# Altium project Fri3D_2020_Sweet4x4_01.PrjPcb
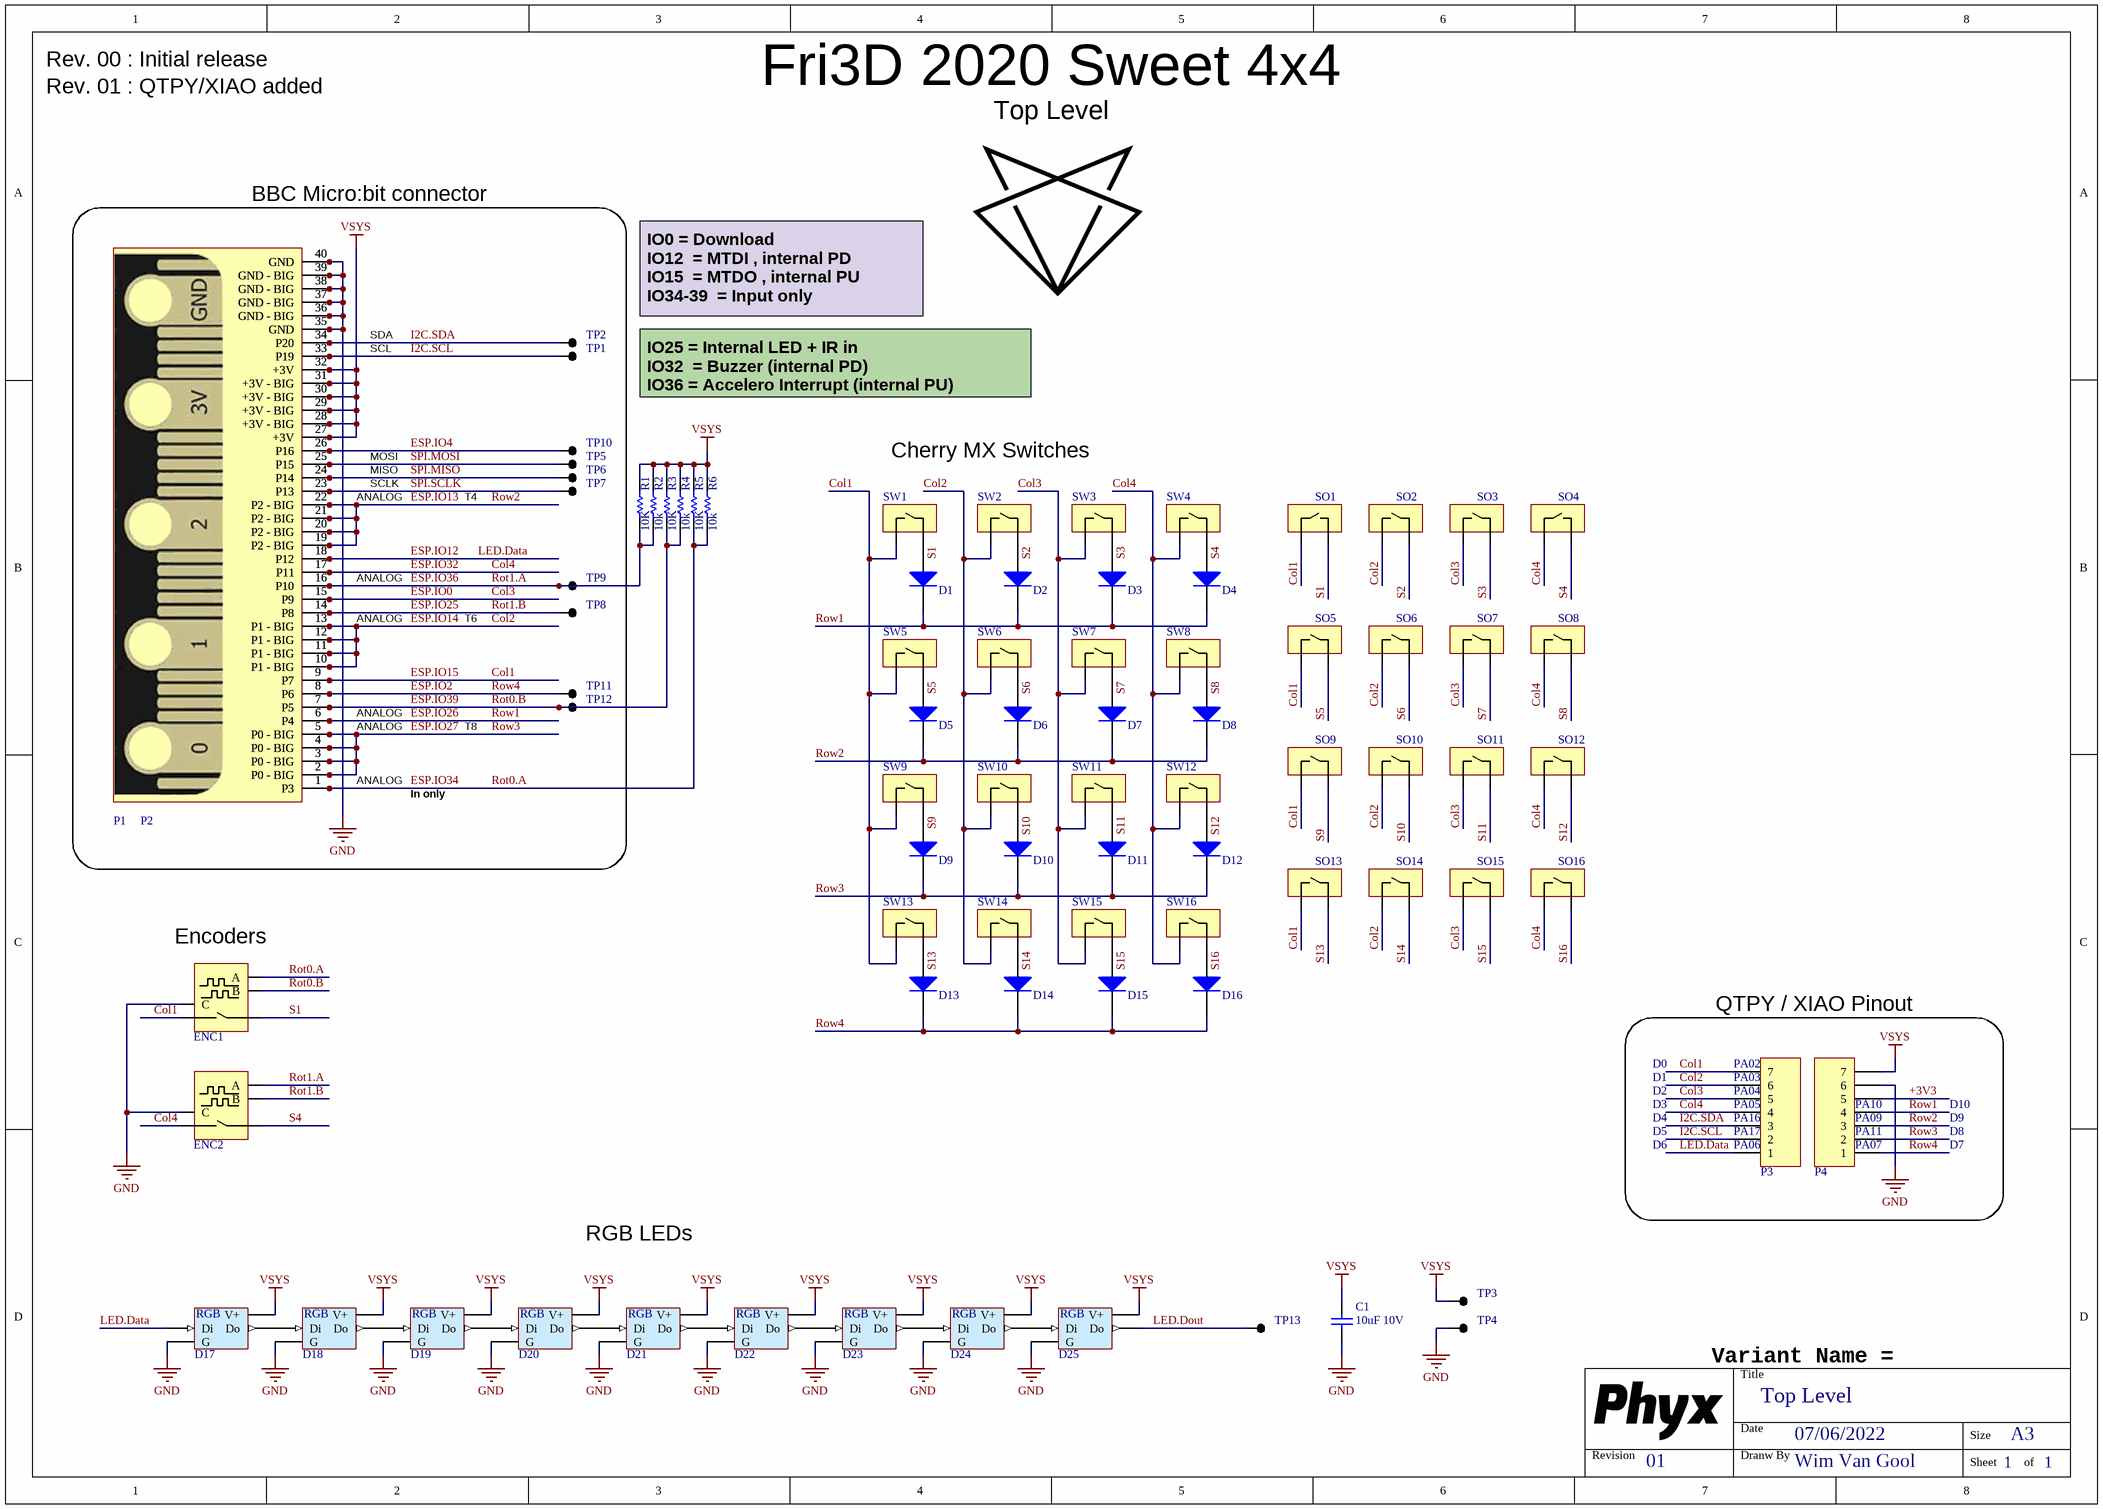
[diagram p0: Fri3D_2020_Sweet4x4_01.SchDoc]
PCB_ENGINEER: WimVG; PCB_REV: 01; PCB_TITLE: Fri3D 2020 Sweet 4x4
1 sheet, 83 parts. Net scope: global (net labels, ports and power ports of the same name join across sheets).
Board file: Fri3D_2020_Sweet4x4_01.PcbDoc

## Sheet Fri3D_2020_Sweet4x4_01.SchDoc: Top Level
size A3; Date: 07/06/2022; DrawnBy: Wim Van Gool; DocumentNumber: 1; Revision: 01; SheetNumber: 1; SheetTotal: 1

### Parts
C1  value 10uF 10V  [C0805_N]  (hidden comment: CAP_CERAMIC)
D1  1N4148 100V 200mA 1Vf@10mA  [DO-35]  (value not drawn)
D2  1N4148 100V 200mA 1Vf@10mA  [DO-35]  (value not drawn)
D3  1N4148 100V 200mA 1Vf@10mA  [DO-35]  (value not drawn)
D4  1N4148 100V 200mA 1Vf@10mA  [DO-35]  (value not drawn)
D5  1N4148 100V 200mA 1Vf@10mA  [DO-35]  (value not drawn)
D6  1N4148 100V 200mA 1Vf@10mA  [DO-35]  (value not drawn)
D7  1N4148 100V 200mA 1Vf@10mA  [DO-35]  (value not drawn)
D8  1N4148 100V 200mA 1Vf@10mA  [DO-35]  (value not drawn)
D9  1N4148 100V 200mA 1Vf@10mA  [DO-35]  (value not drawn)
D10  1N4148 100V 200mA 1Vf@10mA  [DO-35]  (value not drawn)
D11  1N4148 100V 200mA 1Vf@10mA  [DO-35]  (value not drawn)
D12  1N4148 100V 200mA 1Vf@10mA  [DO-35]  (value not drawn)
D13  1N4148 100V 200mA 1Vf@10mA  [DO-35]  (value not drawn)
D14  1N4148 100V 200mA 1Vf@10mA  [DO-35]  (value not drawn)
D15  1N4148 100V 200mA 1Vf@10mA  [DO-35]  (value not drawn)
D16  1N4148 100V 200mA 1Vf@10mA  [DO-35]  (value not drawn)
D17  WS2812 based digital RGB LED 5050 Black package  [LED_5050_WS2812B_BLACK]  (value not drawn)
D18  WS2812 based digital RGB LED 5050 Black package  [LED_5050_WS2812B_BLACK]  (value not drawn)
D19  WS2812 based digital RGB LED 5050 Black package  [LED_5050_WS2812B_BLACK]  (value not drawn)
D20  WS2812 based digital RGB LED 5050 Black package  [LED_5050_WS2812B_BLACK]  (value not drawn)
D21  WS2812 based digital RGB LED 5050 Black package  [LED_5050_WS2812B_BLACK]  (value not drawn)
D22  WS2812 based digital RGB LED 5050 Black package  [LED_5050_WS2812B_BLACK]  (value not drawn)
D23  WS2812 based digital RGB LED 5050 Black package  [LED_5050_WS2812B_BLACK]  (value not drawn)
D24  WS2812 based digital RGB LED 5050 Black package  [LED_5050_WS2812B_BLACK]  (value not drawn)
D25  WS2812 based digital RGB LED 5050 Black package  [LED_5050_WS2812B_BLACK]  (value not drawn)
ENC1  Rotary Encoder with Switch  [PEC11-4215F-S0024]  (value not drawn)
ENC2  Rotary Encoder with Switch  [PEC11-4215F-S0024]  (value not drawn)
P1  MicroBit 90deg connector Cylconn  [MicroBIT_CYLCONN_SMD_90]  (value not drawn)
P2  MicroBit 180deg connector Cylconn  [MicroBIT_CYLCONN_SMD_180]  (value not drawn)
P3  Header 7  [HDR1X7]  (value not drawn)
P4  Header 7  [HDR1X7]  (value not drawn)
R1  value 10K  [R0603_N]  (hidden comment: RESISTOR)
R2  value 10k  [RES_10mm]  (hidden comment: RESISTOR)
R3  value 10K  [R0603_N]  (hidden comment: RESISTOR)
R4  value 10k  [RES_10mm]  (hidden comment: RESISTOR)
R5  value 10K  [R0603_N]  (hidden comment: RESISTOR)
R6  value 10k  [RES_10mm]  (hidden comment: RESISTOR)
SO1  Kailh MX Socket  [Kailh_MX_Socket]  (value not drawn)
SO2  Kailh MX Socket  [Kailh_MX_Socket]  (value not drawn)
SO3  Kailh MX Socket  [Kailh_MX_Socket]  (value not drawn)
SO4  Kailh MX Socket  [Kailh_MX_Socket]  (value not drawn)
SO5  Kailh MX Socket  [Kailh_MX_Socket]  (value not drawn)
SO6  Kailh MX Socket  [Kailh_MX_Socket]  (value not drawn)
SO7  Kailh MX Socket  [Kailh_MX_Socket]  (value not drawn)
SO8  Kailh MX Socket  [Kailh_MX_Socket]  (value not drawn)
SO9  Kailh MX Socket  [Kailh_MX_Socket]  (value not drawn)
SO10  Kailh MX Socket  [Kailh_MX_Socket]  (value not drawn)
SO11  Kailh MX Socket  [Kailh_MX_Socket]  (value not drawn)
SO12  Kailh MX Socket  [Kailh_MX_Socket]  (value not drawn)
SO13  Kailh MX Socket  [Kailh_MX_Socket]  (value not drawn)
SO14  Kailh MX Socket  [Kailh_MX_Socket]  (value not drawn)
SO15  Kailh MX Socket  [Kailh_MX_Socket]  (value not drawn)
SO16  Kailh MX Socket  [Kailh_MX_Socket]  (value not drawn)
SW1  Cherry MX Blue  [Cherry_MX1A]  (value not drawn)
SW2  Cherry MX Blue  [Cherry_MX1A]  (value not drawn)
SW3  Cherry MX Blue  [Cherry_MX1A]  (value not drawn)
SW4  Cherry MX Blue  [Cherry_MX1A]  (value not drawn)
SW5  Cherry MX Blue  [Cherry_MX1A]  (value not drawn)
SW6  Cherry MX Blue  [Cherry_MX1A]  (value not drawn)
SW7  Cherry MX Blue  [Cherry_MX1A]  (value not drawn)
SW8  Cherry MX Blue  [Cherry_MX1A]  (value not drawn)
SW9  Cherry MX Blue  [Cherry_MX1A]  (value not drawn)
SW10  Cherry MX Blue  [Cherry_MX1A]  (value not drawn)
SW11  Cherry MX Blue  [Cherry_MX1A]  (value not drawn)
SW12  Cherry MX Blue  [Cherry_MX1A]  (value not drawn)
SW13  Cherry MX Blue  [Cherry_MX1A]  (value not drawn)
SW14  Cherry MX Blue  [Cherry_MX1A]  (value not drawn)
SW15  Cherry MX Blue  [Cherry_MX1A]  (value not drawn)
SW16  Cherry MX Blue  [Cherry_MX1A]  (value not drawn)
TP1  TEST_PAD  [TP_1.5mm_0.9mm]  (value not drawn)
TP2  TEST_PAD  [TP_1.5mm_0.9mm]  (value not drawn)
TP3  TEST_PAD  [TP_1.5mm_0.9mm]  (value not drawn)
TP4  TEST_PAD  [TP_1.5mm_0.9mm]  (value not drawn)
TP5  TEST_PAD  [TP_1.5mm_0.9mm]  (value not drawn)
TP6  TEST_PAD  [TP_1.5mm_0.9mm]  (value not drawn)
TP7  TEST_PAD  [TP_1.5mm_0.9mm]  (value not drawn)
TP8  TEST_PAD  [TP_1.5mm_0.9mm]  (value not drawn)
TP9  TEST_PAD  [TP_1.5mm_0.9mm]  (value not drawn)
TP10  TEST_PAD  [TP_1.5mm_0.9mm]  (value not drawn)
TP11  TEST_PAD  [TP_1.5mm_0.9mm]  (value not drawn)
TP12  TEST_PAD  [TP_1.5mm_0.9mm]  (value not drawn)
TP13  TEST_PAD  [TP_1.5mm_0.9mm]  (value not drawn)

### Blocks framed on the sheet
BBC Micro:bit connector: P1 P2 TP1 TP2 TP5-TP12
QTPY / XIAO Pinout: P3 P4

### Nets
GND: C1.2 D17.3(G) D18.3(G) D19.3(G) D20.3(G) D21.3(G) D22.3(G) D23.3(G) D24.3(G) D25.3(G) ENC1.C ENC2.C P1.35(GND) P1.36(GND_-_BIG) P1.37(GND_-_BIG) P1.38(GND_-_BIG) P1.39(GND_-_BIG) P1.40(GND) P2.35(GND) P2.36(GND_-_BIG) P2.37(GND_-_BIG) P2.38(GND_-_BIG) P2.39(GND_-_BIG) P2.40(GND) P4.6 TP4.1
VSYS: C1.1 D17.1(V+) D18.1(V+) D19.1(V+) D20.1(V+) D21.1(V+) D22.1(V+) D23.1(V+) D24.1(V+) D25.1(V+) P1.27(+3V) P1.28(+3V_-_BIG) P1.29(+3V_-_BIG) P1.30(+3V_-_BIG) P1.31(+3V_-_BIG) P1.32(+3V) P2.27(+3V) P2.28(+3V_-_BIG) P2.29(+3V_-_BIG) P2.30(+3V_-_BIG) P2.31(+3V_-_BIG) P2.32(+3V) P4.7 R1.1 R2.1 R3.1 R4.1 R5.1 R6.1 TP3.1
+3V3: P4.5
Col1: ENC1.1 P1.9(P7) P2.9(P7) P3.7 SO1.2 SO5.1 SO9.1 SO13.1 SW1.1 SW5.1 SW9.1 SW13.1  [also labelled ESP.IO15]
Col2: P1.10(P1_-_BIG) P1.11(P1_-_BIG) P1.12(P1_-_BIG) P1.13(P1_-_BIG) P2.10(P1_-_BIG) P2.11(P1_-_BIG) P2.12(P1_-_BIG) P2.13(P1_-_BIG) P3.6 SO2.1 SO6.1 SO10.1 SO14.1 SW2.1 SW6.1 SW10.1 SW14.1  [also labelled ESP.IO14]
Col3: P1.15(P9) P2.15(P9) P3.5 SO3.1 SO7.1 SO11.1 SO15.1 SW3.1 SW7.1 SW11.1 SW15.1  [also labelled ESP.IO0]
Col4: ENC2.1 P1.17(P11) P2.17(P11) P3.4 SO4.2 SO8.1 SO12.1 SO16.1 SW4.1 SW8.1 SW12.1 SW16.1  [also labelled ESP.IO32]
ESP.IO2: D13.C D14.C D15.C D16.C P1.8(P6) P2.8(P6) P4.1 TP11.1  [also labelled Row4]
ESP.IO4: P1.26(P16) P2.26(P16) TP10.1
ESP.IO12: D17.4(Di) P1.18(P12) P2.18(P12) P3.1  [also labelled LED.Data]
ESP.IO13: D5.C D6.C D7.C D8.C P1.19(P2_-_BIG) P1.20(P2_-_BIG) P1.21(P2_-_BIG) P1.22(P2_-_BIG) P2.19(P2_-_BIG) P2.20(P2_-_BIG) P2.21(P2_-_BIG) P2.22(P2_-_BIG) P4.3  [also labelled Row2]
ESP.IO25: ENC2.B P1.14(P8) P2.14(P8) TP8.1  [also labelled Rot1.B]
ESP.IO26: D1.C D2.C D3.C D4.C P1.6(P4) P2.6(P4) P4.4  [also labelled Row1]
ESP.IO27: D9.C D10.C D11.C D12.C P1.2(P0_-_BIG) P1.3(P0_-_BIG) P1.4(P0_-_BIG) P1.5(P0_-_BIG) P2.2(P0_-_BIG) P2.3(P0_-_BIG) P2.4(P0_-_BIG) P2.5(P0_-_BIG) P4.2  [also labelled Row3]
ESP.IO34: ENC1.A P1.1(P3) P2.1(P3) R5.2 R6.2  [also labelled Rot0.A]
ESP.IO36: ENC2.A P1.16(P10) P2.16(P10) R1.2 R2.2 TP9.1  [also labelled Rot1.A]
ESP.IO39: ENC1.B P1.7(P5) P2.7(P5) R3.2 R4.2 TP12.1  [also labelled Rot0.B]
I2C.SCL: P1.33(P19) P2.33(P19) P3.2 TP1.1
I2C.SDA: P1.34(P20) P2.34(P20) P3.3 TP2.1
LED.Dout: D25.2(Do) TP13.1
S1: D1.A ENC1.2 SO1.1 SW1.2
S2: D2.A SO2.2 SW2.2
S3: D3.A SO3.2 SW3.2
S4: D4.A ENC2.2 SO4.1 SW4.2
S5: D5.A SO5.2 SW5.2
S6: D6.A SO6.2 SW6.2
S7: D7.A SO7.2 SW7.2
S8: D8.A SO8.2 SW8.2
S9: D9.A SO9.2 SW9.2
S10: D10.A SO10.2 SW10.2
S11: D11.A SO11.2 SW11.2
S12: D12.A SO12.2 SW12.2
S13: D13.A SO13.2 SW13.2
S14: D14.A SO14.2 SW14.2
S15: D15.A SO15.2 SW15.2
S16: D16.A SO16.2 SW16.2
SPI.MISO: P1.24(P14) P2.24(P14) TP6.1
SPI.MOSI: P1.25(P15) P2.25(P15) TP5.1
SPI.SCLK: P1.23(P13) P2.23(P13) TP7.1
NetD17_2: D17.2(Do) D18.4(Di)
NetD18_2: D18.2(Do) D19.4(Di)
NetD19_2: D19.2(Do) D20.4(Di)
NetD20_2: D20.2(Do) D21.4(Di)
NetD21_2: D21.2(Do) D22.4(Di)
NetD22_2: D22.2(Do) D23.4(Di)
NetD23_2: D23.2(Do) D24.4(Di)
NetD24_2: D24.2(Do) D25.4(Di)

### Notes on the sheet
- Rev. 00 : Initial release
- Rev. 01 : QTPY/XIAO added
- IO0	= Download
  IO12 	= MTDI , internal PD
  IO15 	= MTDO , internal PU
  IO34-39 	= Input only
- SDA
- SCL
- IO25	= Internal LED + IR in
  IO32 	= Buzzer (internal PD)
  IO36	= Accelero Interrupt (internal PU)
- ANALOG
- MOSI
- MISO
- SCLK
- T4
- Cherry MX Switches
- T6
- T8
- In only
- (near ENC1) Encoders
- D0
- D1
- D2
- D3
- D4
- (near P3) PA02
- (near P3) PA03
- (near P3) PA04
- (near P3) PA05
- (near P3) PA16
- (near P4) PA09
- (near P4) PA10
- D9
- D10
- D5
- D6
- (near P3) PA06
- (near P3) PA17
- (near P4) PA07
- (near P4) PA11
- D7
- D8
- RGB LEDs
- Variant Name =
- Title
- Revision
- Date
- Dranw By
- Size
- A3
- Sheet
- of
- (in symbol LED # RGB WS2812B-5050 BL) RGB

### Library data of the parts
C1 = CAP # 10uF 10V 0805: Capacitor Ceramic; Supplier 1: Farnell; Supplier Part Number 1: 2320859
D1-D16 = DIO 1N4148 DO-35: Default Diode; Value: 1N4148; Supplier 1: LCSC; Supplier Part Number 1: C14538; Supplier 2: LCSC; Supplier Part Number 2: C14516
D17-D25 = LED # RGB WS2812B-5050 BL: =Description; Value: WS218B 5050 BL; Supplier 1: Aliexpress; Supplier Part Number 1: WS2812B Black 5050; Supplier 2: LCSC; Supplier Part Number 2: C114586
ENC1 ENC2 = ENC ROT INC 24-24ppr SW: Value: PEC11-4215F-S0024; Supplier 1: Farnell; Supplier Part Number 1: 1653380
P1 = MicroBit # RA Cylconn: Supplier 1: TaoBao
P2 = MicroBit # Cylconn: Supplier 1: TaoBao
P3 P4 = Pin Header 2.54mm 7way
R1 R3 R5 = RES # 10K 0603: Supplier 1: Farnell; Supplier Part Number 1: 2502397; Supplier 2: LCSC; Supplier Part Number 2: C25804; Supplier 3: Generic; Supplier Part Number 3: 10K 1% 0603
R2 R4 R6 = RES 10k 1/4W: Supplier 1: LCSC; Supplier Part Number 1: C58673; Supplier 3: Generic; Supplier Part Number 3: 10k 1/4W 1% TH 10mm
SO1-SO16 = SW # Socket MX Kailh: Value: CPG151101S11; Supplier 1: NovelKeys
SW1-SW16 = SW Cherry MX1A-E1NN Blue: Supplier 1: Digi-key; Supplier Part Number 1: CH196-ND; Value: MX1A-E1NN; Supplier 2: Mouser; Supplier Part Number 2: 540-MX1A-E1NN
TP1-TP13 = TP 1.5mm: Value: NO BOM

## Assembly variants
Default: not fitted C2 C3 C4 C5 C6 C7 C8 C9 D26 D27 D28 ENC1 ENC2 F1 J1 P1 P3 P4 R1 R2 R2 R3 R4 R4 R5 R6 SO1 SO2 SO3 SO4 SO5 SO6 SO7 SO8 SO9 SO10 SO11 SO12 SO13 SO14 SO15 SO16 U1 Y1
Standalone: not fitted ENC1 ENC2 P1 P2 R1 R2 R3 R4 R5 R6 SO1 SO2 SO3 SO4 SO5 SO6 SO7 SO8 SO9 SO10 SO11 SO12 SO13 SO14 SO15 SO16